# Altium schematic sheet Auxiliary_Circuit.SchDoc: <Document>
size Letter; Engineer: <Engineer>; Organization: UPEL; Address1: USU Power Electronics Lab; Address2: USTAR Building 620, RM 118; Address3: 1600 N 620 E; Address4: North Logan, UT 84341; DocumentNumber: 2; Revision: v1; SheetNumber: 2; SheetTotal: 16; ProjectName: <Project>
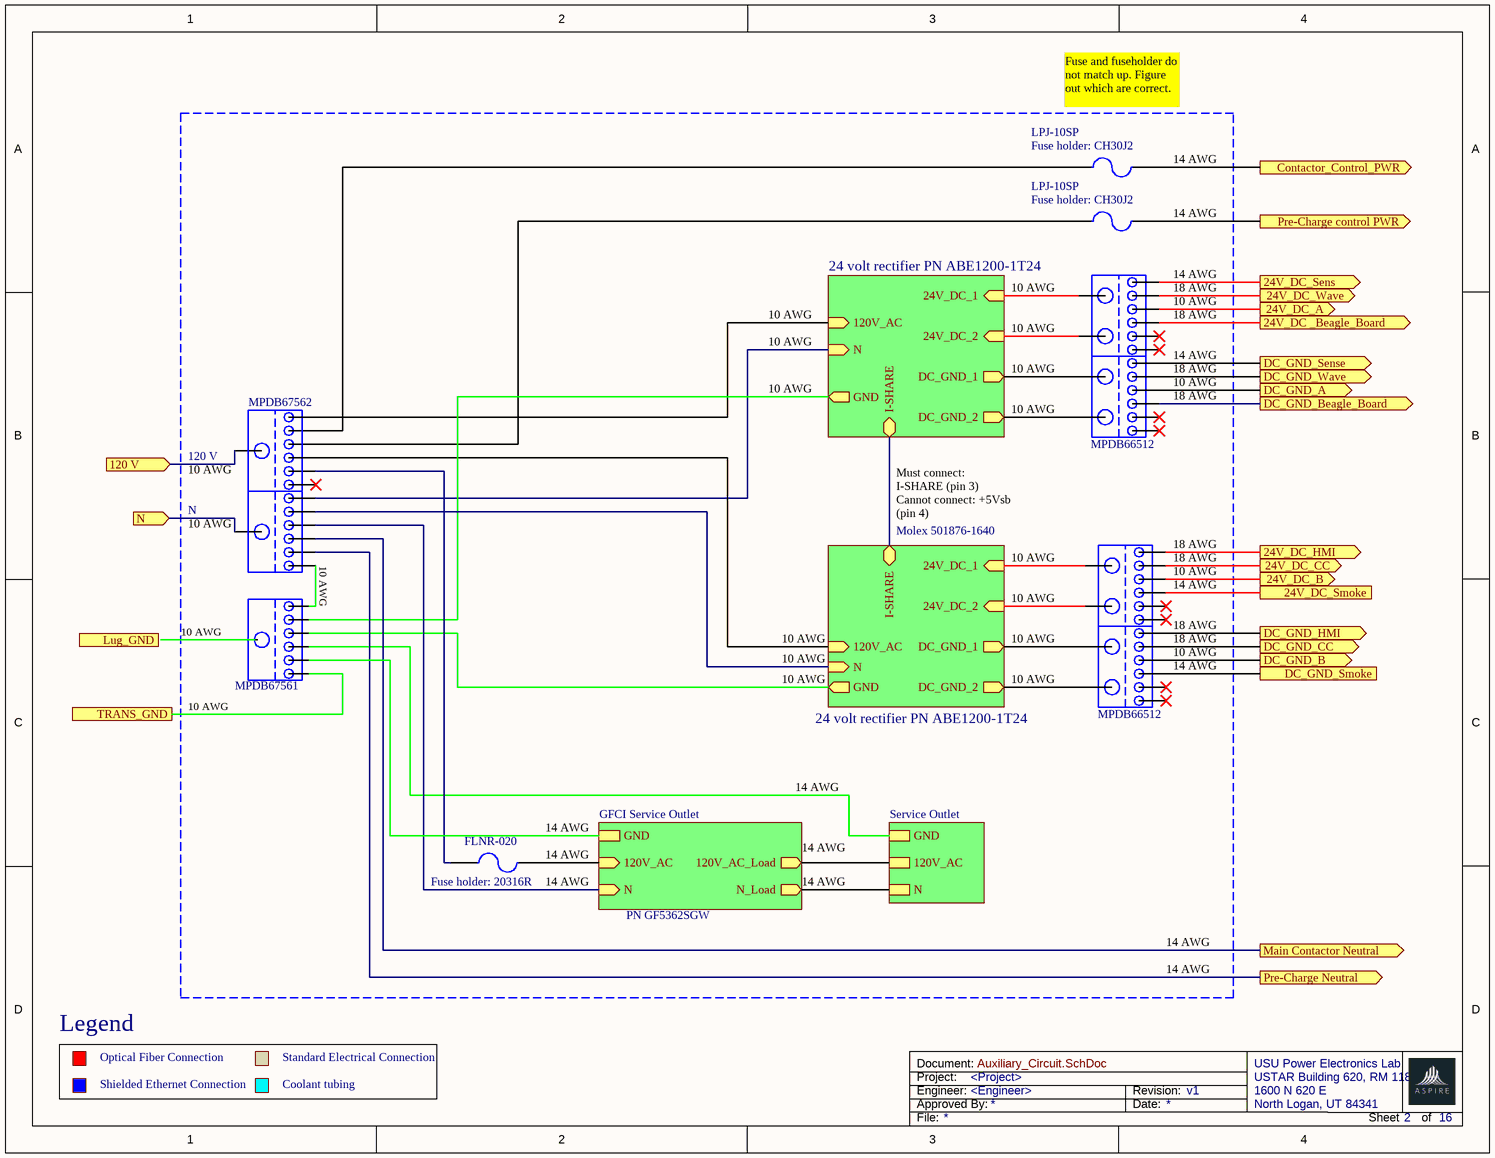
[diagram p0: Auxiliary_Circuit.SchDoc]

## Parts
*  MPDB67561
F73  LPJ-10SP  [PIN-W2/E2.8]
F74  LPJ-10SP  [PIN-W2/E2.8]
FLNR-020  Fuse 2  [PIN-W2/E2.8]  (value not drawn)
J18  MPDB66512
J19  MPDB67562
J20  MPDB66512

## Sub-sheets
24 volt rectifier PN ABE1200-1T24 = File Name: 120V_AC (in), N (in), 24V_DC_1 (in), DC_GND_1 (out), 24V_DC_2 (in), DC_GND_2 (out), GND (out), I-SHARE (bidir)
24 volt rectifier PN ABE1200-1T24 = File Name: 120V_AC (in), N (in), 24V_DC_1 (in), DC_GND_1 (out), 24V_DC_2 (in), DC_GND_2 (out), GND (out), I-SHARE (bidir)
GFCI Service Outlet = File Name: GND, 120V_AC (in), N (in), 120V_AC_Load (out), N_Load (out)
Service Outlet = File Name: GND, 120V_AC, N

## Ports
24V_DC _Beagle_Board (out), 24V_DC_A (out), 24V_DC_B (out), 24V_DC_CC (out), 24V_DC_HMI (out), 24V_DC_Sens (out), 24V_DC_Smoke, 24V_DC_Wave (out), 120 V (in), Contactor_Control_PWR (out), DC_GND_A (out), DC_GND_B (out), DC_GND_Beagle_Board (out), DC_GND_CC (out), DC_GND_HMI (out), DC_GND_Sense (out), DC_GND_Smoke, DC_GND_Wave (out), Lug_GND, Main Contactor Neutral (out), N (in), Pre-Charge control PWR (out), Pre-Charge Neutral (out), TRANS_GND

## Nets
24V_DC _Beagle_Board: J18.1 ; port 24V_DC _Beagle_Board
24V_DC_A: J18.2 ; port 24V_DC_A
24V_DC_B: J20.2 ; port 24V_DC_B
24V_DC_CC: J20.1 ; port 24V_DC_CC
24V_DC_HMI: J20.2 ; port 24V_DC_HMI
24V_DC_Sens: J18.2 ; port 24V_DC_Sens
24V_DC_Smoke: J20.1 ; port 24V_DC_Smoke
24V_DC_Wave: J18.1 ; port 24V_DC_Wave
120 V: J19.0 ; port 120 V
Contactor_Control_PWR: F73.2 ; port Contactor_Control_PWR
DC_GND_A: J18.2 ; port DC_GND_A
DC_GND_B: J20.2 ; port DC_GND_B
DC_GND_Beagle_Board: J18.1 ; port DC_GND_Beagle_Board
DC_GND_CC: J20.1 ; port DC_GND_CC
DC_GND_HMI: J20.2 ; port DC_GND_HMI
DC_GND_Sense: J18.2 ; port DC_GND_Sense
DC_GND_Smoke: J20.1 ; port DC_GND_Smoke
DC_GND_Wave: J18.1 ; port DC_GND_Wave
Main Contactor Neutral: J19.1 ; port Main Contactor Neutral
N: J19.0 ; port N
Pre-Charge control PWR: F74.2 ; port Pre-Charge control PWR
Pre-Charge Neutral: J19.1 ; port Pre-Charge Neutral
NetF73_1: F73.1 J19.5
NetF74_1: F74.1 J19.4
NetFLNR-020_1: FLNR-020.1 J19.3
NetFLNR-020_2: FLNR-020.2 ; sheet GFCI Service Outlet/120V_AC
NetJ18_0: J18.0 ; sheet 24 volt rectifier PN ABE1200-1T24/DC_GND_2
NetJ18_0: J18.0 ; sheet 24 volt rectifier PN ABE1200-1T24/DC_GND_1  [a separate net that carries the same name]
NetJ18_0: J18.0 ; sheet 24 volt rectifier PN ABE1200-1T24/24V_DC_2  [a separate net that carries the same name]
NetJ18_0: J18.0 ; sheet 24 volt rectifier PN ABE1200-1T24/24V_DC_1  [a separate net that carries the same name]
NetJ19_1: J19.1 ; sheet 24 volt rectifier PN ABE1200-1T24/N
NetJ19_1: J19.1 ; sheet 24 volt rectifier PN ABE1200-1T24/120V_AC  [a separate net that carries the same name]
NetJ19_1: J19.1 ; sheet 24 volt rectifier PN ABE1200-1T24/N  [a separate net that carries the same name]
NetJ19_2: J19.2 ; sheet GFCI Service Outlet/N
NetJ19_5: J19.5 ; sheet 24 volt rectifier PN ABE1200-1T24/120V_AC
NetJ20_0: J20.0 ; sheet 24 volt rectifier PN ABE1200-1T24/DC_GND_2
NetJ20_0: J20.0 ; sheet 24 volt rectifier PN ABE1200-1T24/DC_GND_1  [a separate net that carries the same name]
NetJ20_0: J20.0 ; sheet 24 volt rectifier PN ABE1200-1T24/24V_DC_2  [a separate net that carries the same name]
NetJ20_0: J20.0 ; sheet 24 volt rectifier PN ABE1200-1T24/24V_DC_1  [a separate net that carries the same name]
(unnamed): sheet 24 volt rectifier PN ABE1200-1T24/I-SHARE, sheet 24 volt rectifier PN ABE1200-1T24/I-SHARE
(unnamed): sheet GFCI Service Outlet/120V_AC_Load, sheet Service Outlet/120V_AC
(unnamed): sheet GFCI Service Outlet/N_Load, sheet Service Outlet/N

## Notes on the sheet
- Fuse and fuseholder do not match up. Figure out which are correct.
- (near F73) Fuse holder: CH30J2
- (near F73) 14 AWG
- (near F74) Fuse holder: CH30J2
- 14 AWG
- 10 AWG
- (near J18) 18 AWG
- (near J18) 10 AWG
- (near J18) 14 AWG
- (near J19) 10 AWG
- (near J19) 120 V
- N
- Molex 501876-1640
- Must connect: I-SHARE (pin 3)
  Cannot connect: +5Vsb (pin 4)
- (near J20) 18 AWG
- (near J20) 10 AWG
- (near J20) 14 AWG
- (near FLNR-020) 14 AWG
- (near FLNR-020) Fuse holder: 20316R
- PN GF5362SGW
- Legend
- Optical Fiber Connection
- Shielded Ethernet Connection
- Standard Electrical Connection
- Coolant tubing
- Project:
- Engineer:
- Document:
- Approved By:
- Date:
- Revision:
- File:
- Sheet
- of

## Library data of the parts
F73 F74 FLNR-020 = Fuse 2: Fuse; Published: 8-Jun-2000; LatestRevisionDate: 17-Jul-2002; LatestRevisionNote: Re-released for DXP Platform.; PackageReference: PIN-W2/E2.8; Publisher: Altium Limited; PackageDescription: Thru-Hole; 2 Leads
J19 = 2_to_12